# Altium schematic sheet RST_SER_1.SchDoc
size A3
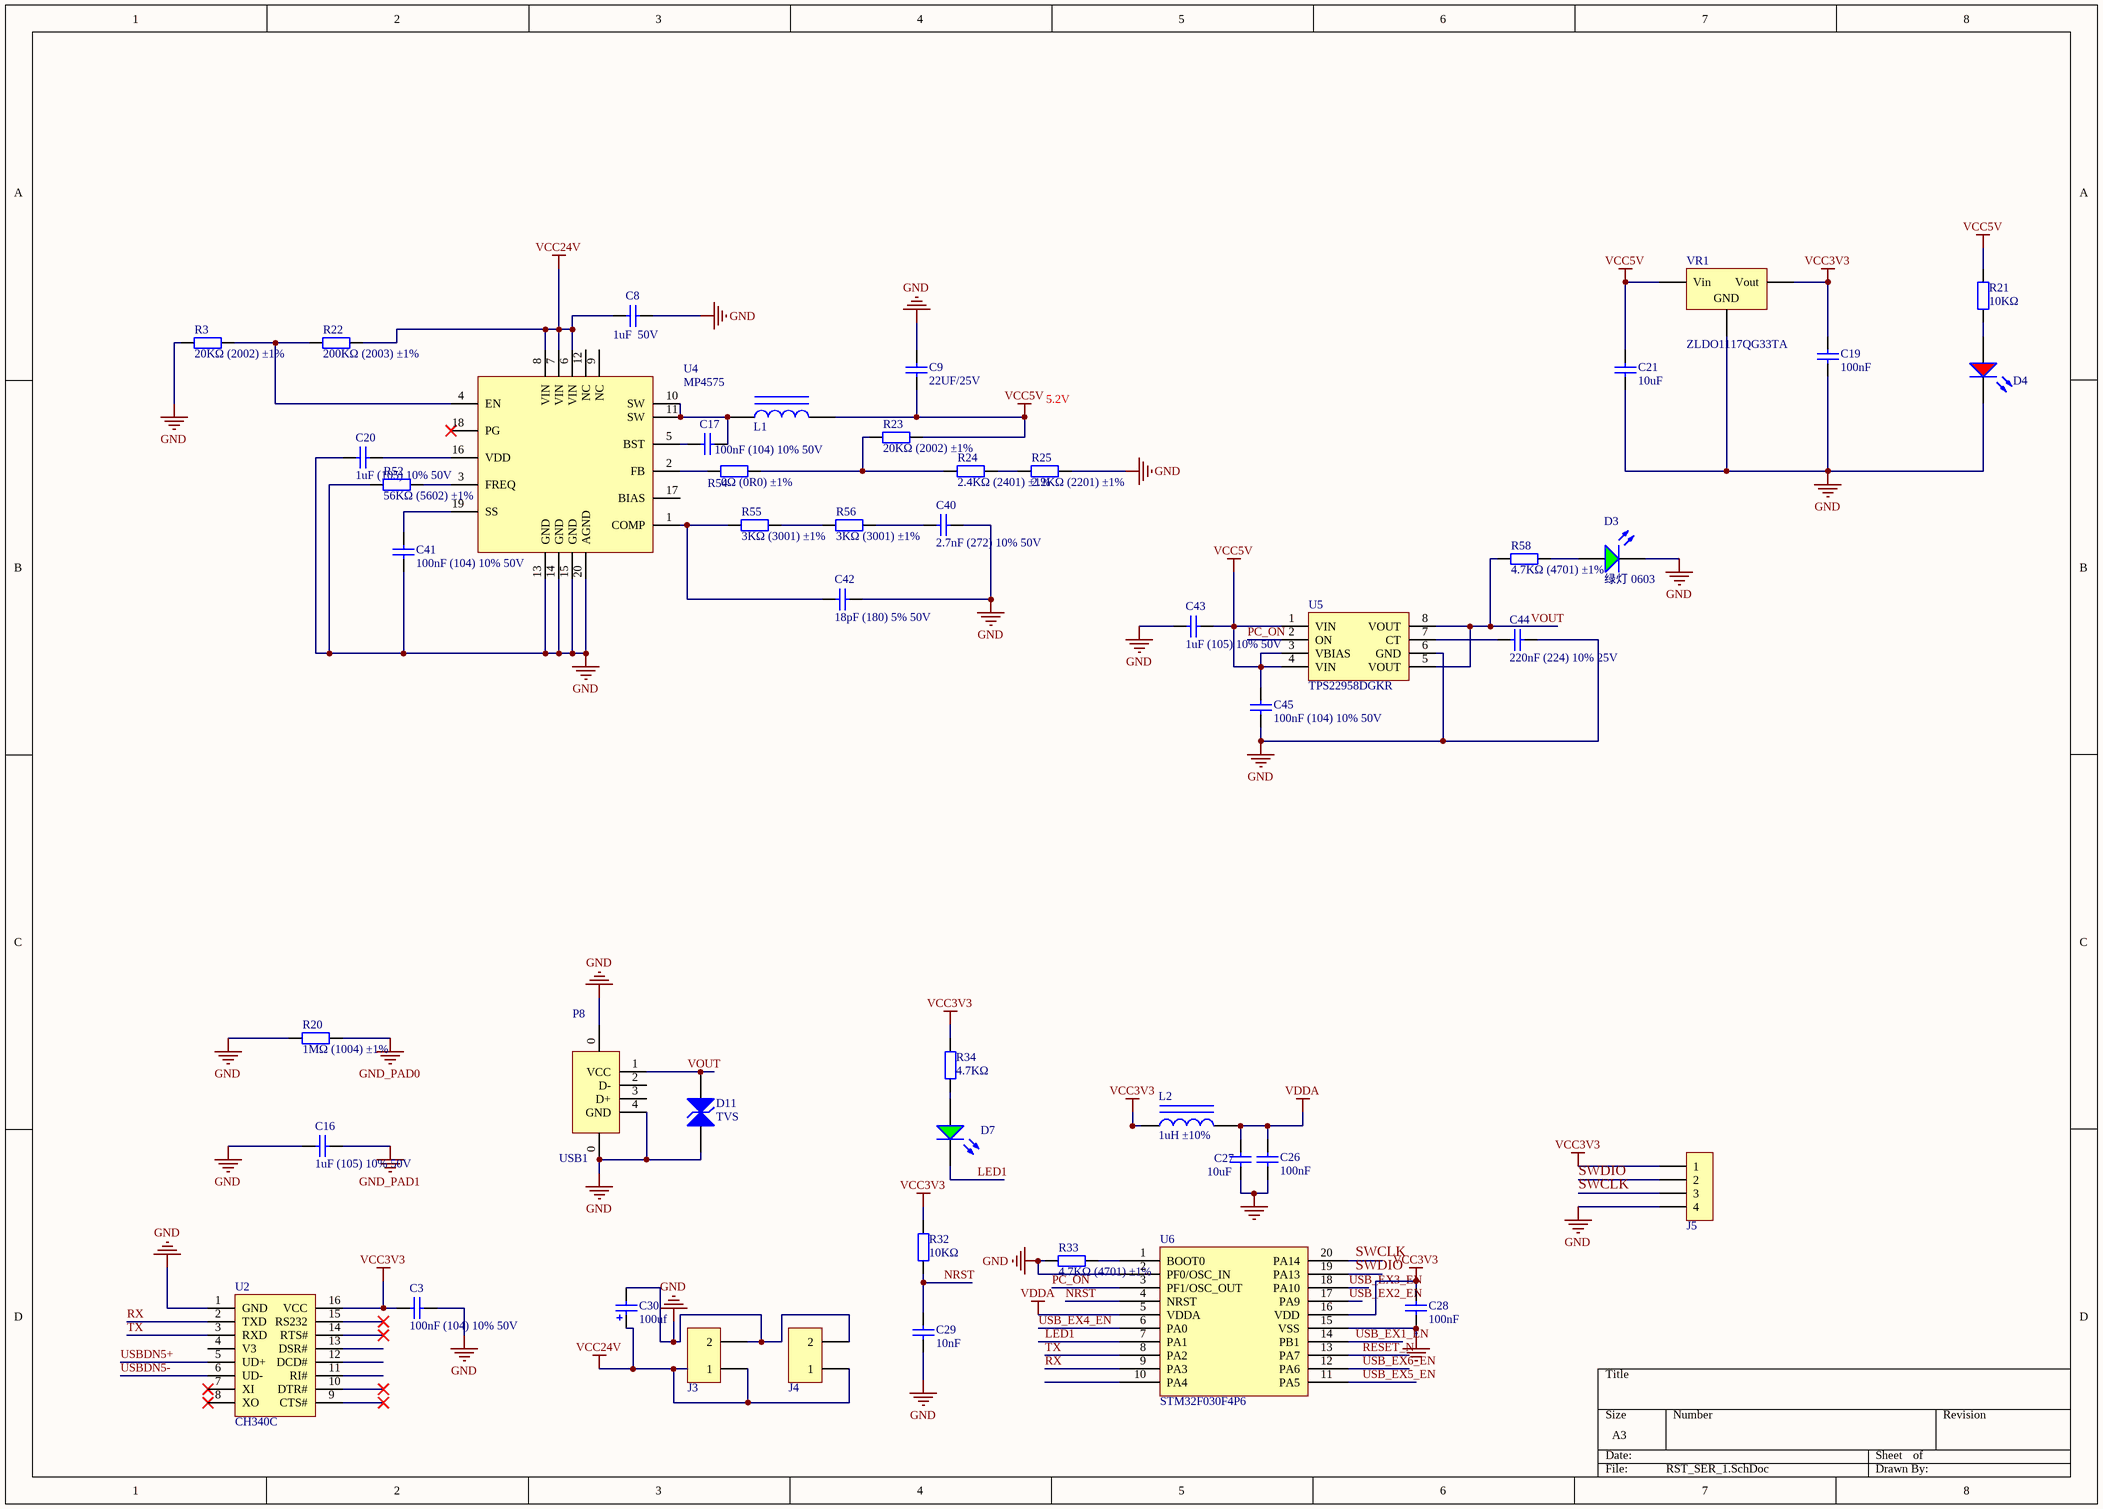
[diagram p0: RST_SER_1.SchDoc]

## Parts
C3  100nF (104) 10% 50V  [0603_C]
C8  1uF  50V  [1206_C]
C9  22UF/25V  [1206_C]
C16  1uF (105) 10% 50V  [0603_C]
C17  100nF (104) 10% 50V  [0603_C]
C19  100nF  [0603_C]
C20  1uF (105) 10% 50V  [0603_C]
C21  10uF  [0603_C]
C26  100nF  [0603_C]
C27  10uF  [0603_C]
C28  100nF  [0603_C]
C29  10nF  [0603_C]
C30  100uf  [E_6.3*5.4]
C40  2.7nF (272) 10% 50V  [0603_C]
C41  100nF (104) 10% 50V  [0603_C]
C42  18pF (180) 5% 50V  [0603_C]
C43  1uF (105) 10% 50V  [0603_C]
C44  220nF (224) 10% 25V  [0603_C]
C45  100nF (104) 10% 50V  [0603_C]
D3  绿灯 0603  [0603_LED_S1]
D4  红灯 0603  [0603_LED_S1]  (value not drawn)
D7  绿灯 0603  [0603_LED_S1]  (value not drawn)
D11  TVS  [SOD-523]
J3  MOTOR  [5557]  (value not drawn)
J4  MOTOR  [5557]  (value not drawn)
J5  header4  [xh-4]  (value not drawn)
L1  induct  [L_SMD,5.7x5.2mm]  (value not drawn)
L2  1uH ±10%  [0805_L]
P8  USB1  [USB-A-TH_AF90-OFFSET - duplicate]
R3  20KΩ (2002) ±1%  [0603_R]
R20  1MΩ (1004) ±1%  [0603_R]
R21  10KΩ  [0603_R]
R22  200KΩ (2003) ±1%  [0603_R]
R23  20KΩ (2002) ±1%  [0603_R]
R24  2.4KΩ (2401) ±1%  [0603_R]
R25  2.2KΩ (2201) ±1%  [0603_R]
R32  10KΩ  [0603_R]
R33  4.7KΩ (4701) ±1%  [0603_R]
R34  4.7KΩ  [0603_R]
R52  56KΩ (5602) ±1%  [0603_R]
R54  0Ω (0R0) ±1%  [0603_R]
R55  3KΩ (3001) ±1%  [0603_R]
R56  3KΩ (3001) ±1%  [0603_R]
R58  4.7KΩ (4701) ±1%  [0603_R]
U2  CH340C  [SOP-16]
U4  MP4575  [TSSOP-20]
U5  TPS22958DGKR  [MSOP-8]
U6  STM32F030F4P6  [TSSOP-20]
VR1  ZLDO1117QG33TA  [SOT-223]

## Nets
GND: C3.2 C8.2 C9.2 C16.1 C19.1 C20.1 C21.1 C26.1 C27.1 C28.1 C29.1 C30.2 C40.2 C41.1 C42.2 C43.1 C44.2 C45.1 D3.K D4.K D11.1(A) J3.2 J4.2 J5.4 P8.0 P8.4(GND) R3.1 R20.1 R25.2 R33.1 R52.1 U2.1(GND) U4.13(GND) U4.14(GND) U4.15(GND) U4.20(AGND) U5.6(GND) U6.2(PF0/OSC_IN) U6.15(VSS) VR1.1(GND)
GND_PAD0: R20.2
GND_PAD1: C16.2
VCC3V3: C3.1 C19.2 C28.2 J5.1 L2.1 R32.2 R34.2 U2.16(VCC) U6.16(VDD) VR1.2(Vout)
VCC5V: C9.1 C21.2 C43.2 C45.2 L1.2 R21.2 R23.2 U5.1(VIN) U5.3(VBIAS) U5.4(VIN) VR1.3(Vin)
VCC24V: C8.1 C30.1 J3.1 J4.1 R22.2 U4.6(VIN) U4.7(VIN) U4.8(VIN)
VDDA: C26.2 C27.2 L2.2 U6.5(VDDA)
LED1: D7.K U6.7(PA1)
NRST: C29.2 R32.1 U6.4(NRST)
PC_ON: U5.2(ON) U6.3(PF1/OSC_OUT)
RESET_N: U6.13(PA7)
RX: U2.2(TXD) U6.9(PA3)
SWCLK: J5.3 U6.20(PA14)
SWDIO: J5.2 U6.19(PA13)
TX: U2.3(RXD) U6.8(PA2)
USB_EX1_EN: U6.14(PB1)
USB_EX2_EN: U6.17(PA9)
USB_EX3_EN: U6.18(PA10)
USB_EX4_EN: U6.6(PA0)
USB_EX5_EN: U6.11(PA5)
USB_EX6_EN: U6.12(PA6)
USBDN5+: U2.5(UD+)
USBDN5-: U2.6(UD-)
VOUT: D11.2(K) P8.1(VCC) R58.1 U5.5(VOUT) U5.8(VOUT)
NetC17_1: C17.1 U4.5(BST)
NetC17_2: C17.2 L1.1 U4.10(SW) U4.11(SW)
NetC20_2: C20.2 U4.16(VDD)
NetC40_1: C40.1 R56.2
NetC41_2: C41.2 U4.19(SS)
NetC42_1: C42.1 R55.1 U4.1(COMP)
NetC44_1: C44.1 U5.7(CT)
NetD3_A: D3.A R58.2
NetD4_A: D4.A R21.1
NetD7_A: D7.A R34.1
NetR3_2: R3.2 R22.1 U4.4(EN)
NetR23_1: R23.1 R24.1 R54.2
NetR24_2: R24.2 R25.1
NetR33_2: R33.2 U6.1(BOOT0)
NetR52_2: R52.2 U4.3(FREQ)
NetR54_1: R54.1 U4.2(FB)
NetR55_2: R55.2 R56.1

Not connected (* = marked no-connect by the designer): P8 2(D-) 3(D+); U2 4(V3) 7(XI)* 8(XO)* 9(CTS#)* 10(DTR#)* 11(RI#) 12(DCD#) 13(DSR#) 14(RTS#)* 15(RS232)*; U4 9(NC) 12(NC) 17(BIAS) 18(PG)*; U6 10(PA4)

## Notes on the sheet
- 5.2V

## Library data of the parts
C3 C17 C19 C26 C28 C41 C45 = 0603 100nF (104) 10% 50V: 贴片电容; ComponentLink1Description: 供应商链接; ComponentLink1URL: http://www.szlcsc.com/product/details_15331.html; Package: 0603; Supplier: LC; SuppliersPartNumber: C14663
C8 = 1206 1uF (105) 10% 50V: 贴片电容; ComponentLink1Description: 供应商链接; ComponentLink1URL: http://www.szlcsc.com/product/details_2200.html; Package: 1206; Supplier: LC; SuppliersPartNumber: C1848
C9 = 1206 10uF (106) 10% 50V: 贴片电容; ComponentLink1Description: 供应商链接; ComponentLink1URL: http://www.szlcsc.com/product/details_14236.html; Package: 1206; Supplier: LC; SuppliersPartNumber: C13585
C16 C20 C43 = 0603 1uF (105) 10% 50V: 贴片电容; ComponentLink1Description: 供应商链接; ComponentLink1URL: http://www.szlcsc.com/product/details_16531.html; Package: 0603; Supplier: LC; SuppliersPartNumber: C15849
C21 C27 = 0603 10uF (106) 10% 10V: 贴片电容; ComponentLink1Description: 供应商链接; ComponentLink1URL: http://www.szlcsc.com/product/details_20411.html; Package: 0603; Supplier: LC; SuppliersPartNumber: C19702
C29 = 0603 10nF (103) 10% 50V: 贴片电容; ComponentLink1Description: 供应商链接; ComponentLink1URL: http://www.szlcsc.com/product/details_58143.html; Package: 0603; Supplier: LC; SuppliersPartNumber: C57112
C30 = C
C40 = 0603 2.7nF (272) 10% 50V: 贴片电容; ComponentLink1Description: 供应商链接; ComponentLink1URL: http://www.szlcsc.com/product/details_1961.html; Package: 0603; Supplier: LC; SuppliersPartNumber: C1609
C42 = 0603 18pF (180) 5% 50V: 贴片电容; ComponentLink1Description: 供应商链接; ComponentLink1URL: http://www.szlcsc.com/product/details_1999.html; Package: 0603; Supplier: LC; SuppliersPartNumber: C1647
C44 = 0603 220nF (224) 10% 25V: 贴片电容; ComponentLink1Description: 供应商链接; ComponentLink1URL: http://www.szlcsc.com/product/details_21832.html; Package: 0603; Supplier: LC; SuppliersPartNumber: C21120
D3 D7 = 0603 绿灯: 发光二极管; ComponentLink1Description: 供应商链接; ComponentLink1URL: http://www.szlcsc.com/product/details_73152.html; Package: 0603; Supplier: LC; SuppliersPartNumber: C72043
D4 = 0603 红灯: 发光二极管; ComponentLink1Description: 供应商链接; ComponentLink1URL: http://www.szlcsc.com/product/details_2659.html; Package: 0603; Supplier: LC; SuppliersPartNumber: C2286
J3 J4 = header2
L2 = 0805 100uH 10%: 贴片电感; ComponentLink1Description: 供应商链接; ComponentLink1URL: http://www.szlcsc.com/product/details_69137.html; Package: 0805; Supplier: LC; SuppliersPartNumber: C68035
R3 R23 = 0603 20KΩ (2002) 1%: 贴片电阻; ComponentLink1Description: 供应商链接; ComponentLink1URL: http://www.szlcsc.com/product/details_4591.html; Package: 0603; Supplier: LC; SuppliersPartNumber: C4184
R20 = 0603 1MΩ (1004) 1%: 贴片电阻; ComponentLink1Description: 供应商链接; ComponentLink1URL: http://www.szlcsc.com/product/details_23662.html; Package: 0603; Supplier: LC; SuppliersPartNumber: C22935
R21 R32 = 0603 10KΩ (1002) 1%: 贴片电阻; ComponentLink1Description: 供应商链接; ComponentLink1URL: http://www.szlcsc.com/product/details_26547.html; Package: 0603; Supplier: LC; SuppliersPartNumber: C25804
R22 = 0603 200KΩ (2003) 1%: 贴片电阻; ComponentLink1Description: 供应商链接; ComponentLink1URL: http://www.szlcsc.com/product/details_26554.html; Package: 0603; Supplier: LC; SuppliersPartNumber: C25811
R24 = 0603 2.4KΩ (2401) 1%: 贴片电阻; ComponentLink1Description: 供应商链接; ComponentLink1URL: http://www.szlcsc.com/product/details_23667.html; Package: 0603; Supplier: LC; SuppliersPartNumber: C22940
R25 = 0603 2.2KΩ (2201) 1%: 贴片电阻; ComponentLink1Description: 供应商链接; ComponentLink1URL: http://www.szlcsc.com/product/details_4597.html; Package: 0603; Supplier: LC; SuppliersPartNumber: C4190
R33 R58 = 0603 4.7KΩ (4701) 1%: 贴片电阻; ComponentLink1Description: 供应商链接; ComponentLink1URL: http://www.szlcsc.com/product/details_23889.html; Package: 0603; Supplier: LC; SuppliersPartNumber: C23162
R34 = 0603 1KΩ (1001) 1%: 贴片电阻; ComponentLink1Description: 供应商链接; ComponentLink1URL: http://www.szlcsc.com/product/details_21904.html; Package: 0603; Supplier: LC; SuppliersPartNumber: C21190
R52 = 0603 56KΩ (5602) 1%: 贴片电阻; ComponentLink1Description: 供应商链接; ComponentLink1URL: http://www.szlcsc.com/product/details_23933.html; Package: 0603; Supplier: LC; SuppliersPartNumber: C23206
R54 = 0603 0Ω (0R0) 1%: 贴片电阻; ComponentLink1Description: 供应商链接; ComponentLink1URL: http://www.szlcsc.com/product/details_21903.html; Package: 0603; Supplier: LC; SuppliersPartNumber: C21189
R55 R56 = 0603 3KΩ (3001) 1%: 贴片电阻; ComponentLink1Description: 供应商链接; ComponentLink1URL: http://www.szlcsc.com/product/details_4618.html; Package: 0603; Supplier: LC; SuppliersPartNumber: C4211
U2 = CH340G
U4 = MP4575: MP4575_TSSOP-20
U6 = STM32F030F4P6: ARM; ComponentLink1Description: 供应商链接; ComponentLink1URL: http://www.szlcsc.com/product/details_33873.html; Package: TSSOP-20; Supplier: LC; SuppliersPartNumber: C32908
VR1 = SOT-223 AMS1117-3.3: 低压差线性稳压(LDO); ComponentLink1Description: 供应商链接; ComponentLink1URL: http://www.szlcsc.com/product/details_6652.html; Package: SOT-223; Supplier: LC; SuppliersPartNumber: C6186